# Altium project Voltage_Follower_PCB.PrjPcb
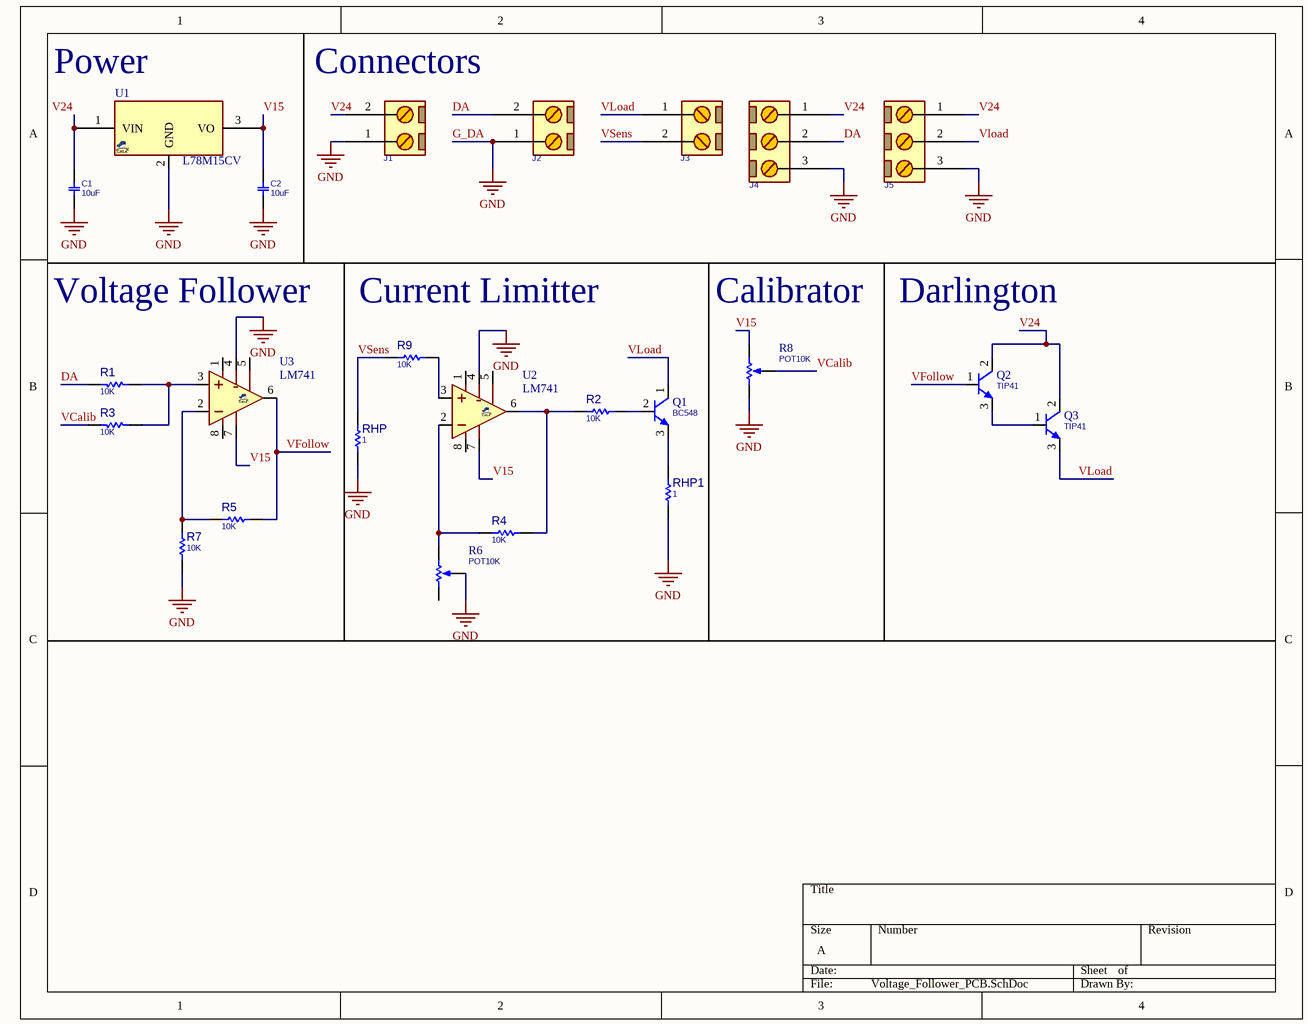
[diagram p0: Voltage_Follower_PCB.SchDoc]
1 sheet, 24 parts. Net scope: global (net labels, ports and power ports of the same name join across sheets).
Board files: Voltage_Follower_PCB.PcbDoc, Voltage_Follower_PCB_Panelize.PcbDoc

## Sheet Voltage_Follower_PCB.SchDoc
size A; SheetNumber: 1; SheetTotal: 1

### Parts
C1  10uF  [C_CERM_D3]
C2  10uF  [C_CERM_D3]
J1  CONN_TB2  [TBG_2]  (value not drawn)
J2  CONN_TB2  [TBG_2]  (value not drawn)
J3  CONN_TB2  [TBG_2]  (value not drawn)
J4  CONN_TB3  [TBG_3]  (value not drawn)
J5  CONN_TB3  [TBG_3]  (value not drawn)
Q1  BC548  [TO92_3]
Q2  TIP41  [TO220_3]
Q3  TIP41  [TO220_3]
R1  10K  [R025W_AX04]
R2  10K  [R025W_AX04]
R3  10K  [R025W_AX04]
R4  10K  [R025W_AX04]
R5  10K  [R025W_AX04]
R6  POT10K  [POT_3296W]
R7  10K  [R025W_AX04]
R8  POT10K  [POT_3296W]
R9  10K  [R025W_AX04]
RHP  1  [RWW5W]
RHP1  1  [RWW5W]
U1  L78M15CV  [TO220_3]
U2  LM741  [DIP_8]
U3  LM741  [DIP_8]

### Nets
G_DA: C1.1 C2.1 J1.1 J2.1 J4.3 J5.3 R6.2(TAP) R7.1 R8.1(TOP) RHP.1 RHP1.1 U1.2(GND) U2.4(V-) U3.4(V-)  [also labelled GND]
DA: J2.2 J4.2 R1.1
V15: C2.2 R8.3(BOT) U1.3(VO) U2.7(V+) U3.7(V+)
V24: C1.2 J1.2 J4.1 J5.1 Q2.2(C) Q3.2(C) U1.1(VIN)
VCalib: R3.1 R8.2(TAP)
VFollow: Q2.1(B) R5.2 U3.6(OUT)
VLoad: J3.1 J5.2 Q1.1(C) Q3.3(E)
VSens: J3.2 R9.1 RHP.2
NetQ1_2: Q1.2(B) R2.2
NetQ1_3: Q1.3(E) RHP1.2
NetQ2_3: Q2.3(E) Q3.1(B)
NetR1_2: R1.2 R3.2 U3.3(IN+)
NetR2_1: R2.1 R4.2 U2.6(OUT)
NetR4_1: R4.1 R6.3(BOT) U2.2(IN-)
NetR5_1: R5.1 R7.2 U3.2(IN-)
NetR9_2: R9.2 U2.3(IN+)

Not connected (* = marked no-connect by the designer): R6 1(TOP); U2 1(OFFSET_NULL) 5(OFFSET_NULL) 8(NC); U3 1(OFFSET_NULL) 5(OFFSET_NULL) 8(NC)

### Notes on the sheet
- (near U1) Power
- (near J1) Connectors
- Voltage Follower
- Current Limitter
- (near R8) Calibrator
- Darlington

### Library data of the parts
C1 C2 = CAP_THD_CER: CAP, THD, CER MULTI LAYER,; DESC: CAP, CER MULTI LAYER,; MANF_P#: MANF_PART#; PARAM2: 50V; PRICE: 100= 1$; MANF: MANF; ASSEMBLY: ASSEMBLY; VALUE: 10uF
J1-J3 = CONN_TB2: CONN, TERMINAL BLOCK, 5.08mm pitch; VALUE: CONN_TB2
J4 J5 = CONN_TB3: CONN, TERMINAL BLOCK, 5.08mm pitch; VALUE: CONN_TB3
Q1 = NPN_BC548_TO92: BJT, NPN, 30v, 0.1A, THD, TO92; PARAM2: 500mW; MANF: FAIRCHILD; PARAM: 30v, 0.1A; MANF_P#: BC548; VALUE: BC548
Q2 Q3 = NPN_TIP41_TO220: BJT, NPN, 60v, 6A, THD, TO-220; PARAM: 60-100v, 6A; PARAM2: 65W; MANF_P#: TIP41A, TIP41B, TIP41C; MANF: ON; VALUE: TIP41
R1-R5 R7 R9 RHP RHP1 = RES_THD: RESISTOR, THD; MANF_P#: RK73H1ETTP4701F; MANF: KOA SPEER; PARAM: 0.063W; DESC: DESCRIPTION; DIST#: MOUSER; PARAM2: 1%; ASSEMBLY: ASSEMBLY; PRICE: 100= 0.5$
  R1-R5 R7 R9: VALUE: 10K
  RHP RHP1: VALUE: 1
R6 R8 = RES_THD_POT_3296W: RESISTOR, THD, Potentiometer; VALUE: POT10K
U1 = VREG_78M15_TO220: REG, Linear, Fixed, 15v, 1.5A, TO220; MANF: ST; MANF_P#: L78M15CV; PARAM: 15v, 1.5A; PARAM2: PARAM2; VALUE: L78M15CV
U2 U3 = LM741_DIP8: AMP, General-Purpose; MANF: Texas Instruments; MANF_P#: LM741CN; VALUE: LM741